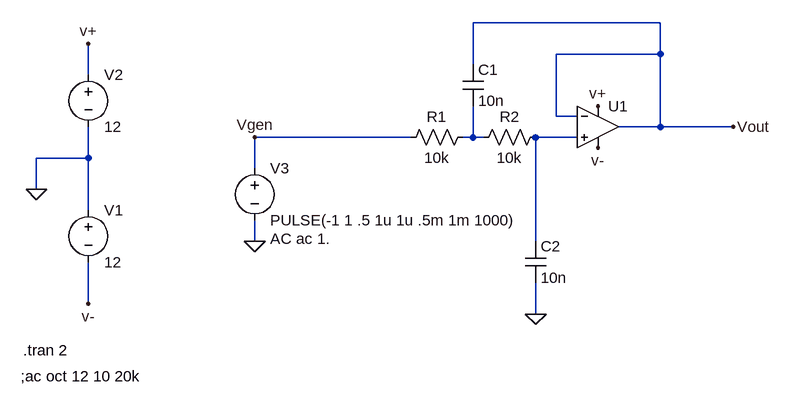
[diagram p0: schematic sallen-key.asc]
sallen-key.asc, the LTspice schematic file:
Version 4
SHEET 1 1088 680
WIRE 896 -128 608 -128
WIRE 896 -80 896 -128
WIRE 896 -80 736 -80
WIRE 608 -64 608 -128
WIRE 16 -48 16 -96
WIRE 736 16 736 -80
WIRE 768 16 736 16
WIRE 896 32 896 -80
WIRE 896 32 832 32
WIRE 1008 32 896 32
WIRE 512 48 272 48
WIRE 608 48 608 0
WIRE 608 48 592 48
WIRE 624 48 608 48
WIRE 768 48 704 48
WIRE 16 80 16 32
WIRE 16 80 -64 80
WIRE 272 96 272 48
WIRE -64 128 -64 80
WIRE 16 160 16 80
WIRE 272 208 272 176
WIRE 704 208 704 48
WIRE 16 304 16 240
WIRE 704 320 704 272
FLAG 272 208 0
FLAG -64 128 0
FLAG 16 -96 v+
FLAG 16 304 v-
FLAG 800 64 v-
FLAG 800 0 v+
FLAG 704 320 0
FLAG 1008 32 Vout
FLAG 272 48 Vgen
SYMBOL voltage 16 144 R0
WINDOW 123 0 0 Left 2
WINDOW 39 0 0 Left 2
SYMATTR InstName V1
SYMATTR Value 12
SYMBOL voltage 16 -64 R0
WINDOW 123 0 0 Left 2
WINDOW 39 0 0 Left 2
SYMATTR InstName V2
SYMATTR Value 12
SYMBOL voltage 272 80 R0
WINDOW 123 24 124 Left 2
WINDOW 39 0 0 Left 2
SYMATTR InstName V3
SYMATTR Value PULSE(-1 1 .5 1u 1u .5m 1m 1000)
SYMATTR Value2 AC ac 1.
SYMBOL Opamps\\UniversalOpamp2 800 32 R0
SYMATTR InstName U1
SYMBOL res 608 32 R90
WINDOW 0 0 56 VBottom 2
WINDOW 3 32 56 VTop 2
SYMATTR InstName R1
SYMATTR Value 10k
SYMBOL res 720 32 R90
WINDOW 0 0 56 VBottom 2
WINDOW 3 32 56 VTop 2
SYMATTR InstName R2
SYMATTR Value 10k
SYMBOL cap 592 -64 R0
SYMATTR InstName C1
SYMATTR Value 10n
SYMBOL cap 688 208 R0
SYMATTR InstName C2
SYMATTR Value 10n
TEXT -84 376 Left 2 !.tran 2
TEXT -88 416 Left 2 !;ac oct 12 10 20k

The netlist it stands for:
* sallen-key.asc
V1 0 v- 12
V2 v+ 0 12
V3 Vgen 0 PULSE(-1 1 .5 1u 1u .5m 1m 1000) AC ac 1.
XU1 N002 Vout v+ v- Vout level.2 Avol=1Meg GBW=10Meg Slew=10Meg ilimit=25m rail=0 Vos=0 phimargin=45 en=0 enk=0 in=0 ink=0 Rin=500Meg  ; pins IN+ IN- V+ V- OUT
R1 N001 Vgen 10k
R2 N002 N001 10k
C1 Vout N001 10n
C2 N002 0 10n
.tran 2
;ac oct 12 10 20k
.lib UniversalOpamps2.sub
.backanno
.end